# EAGLE design model140 (EAGLE 7.7.0)
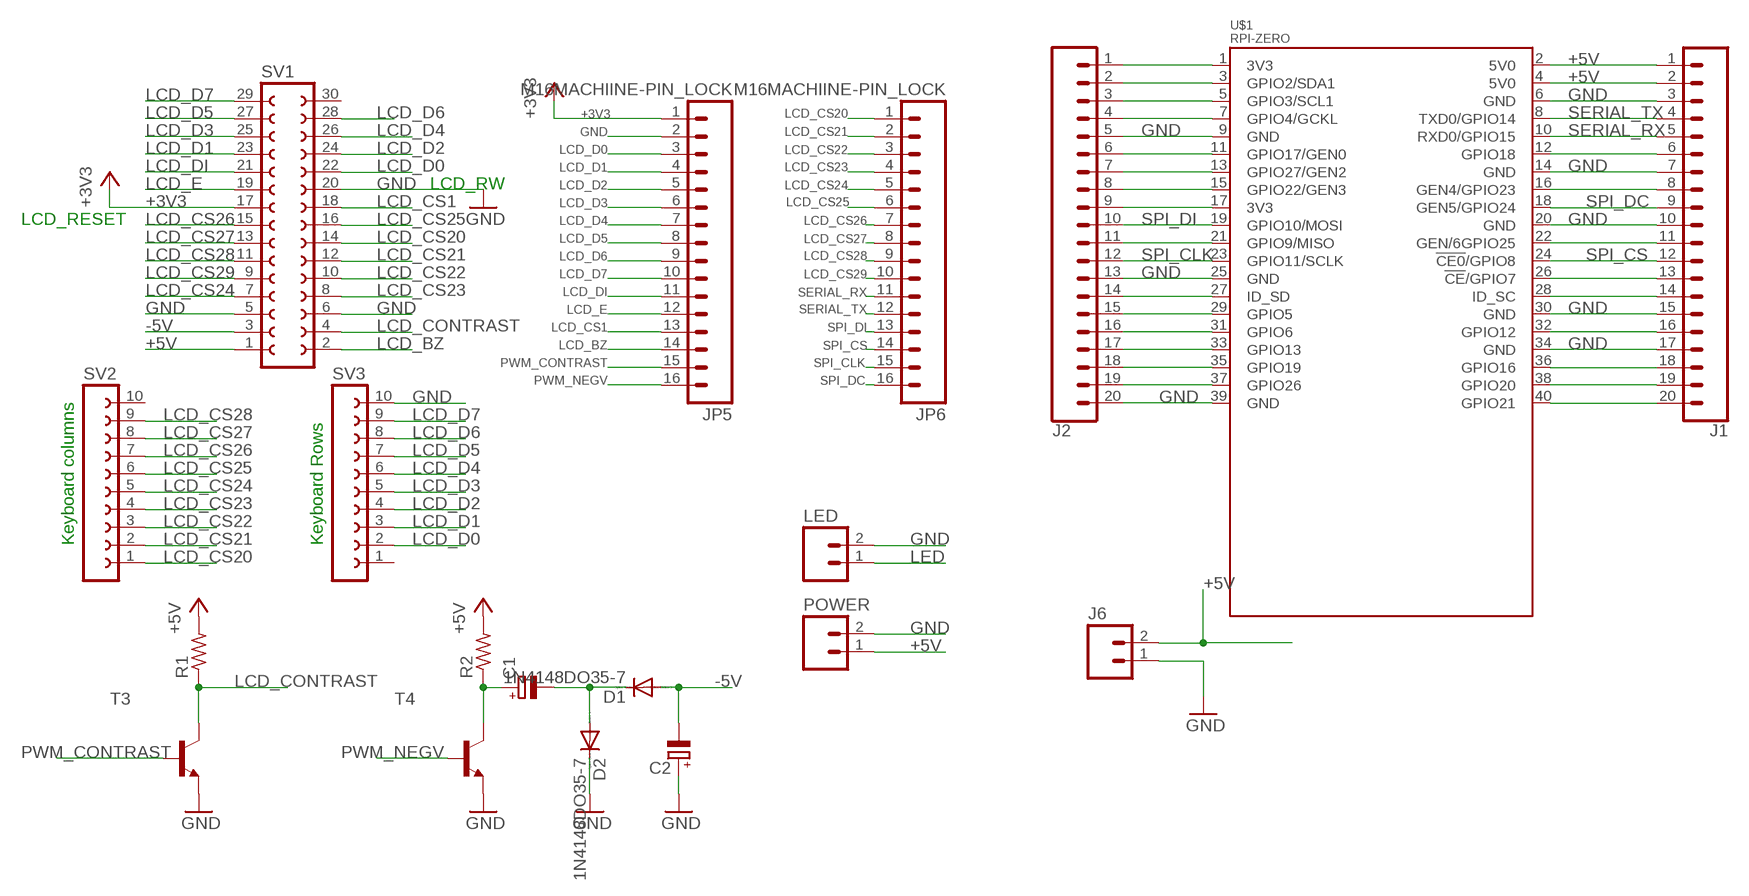
[diagram p0: schematic, sheet 1]

## Parts
C1  CPOL-EUE2.5-7  [E2,5-7]
C2  CPOL-EUE2.5-7  [E2,5-7]
D1  1N4148DO35-7  [DO35-7]
D2  1N4148DO35-7  [DO35-7]
J1  CONN_20  [1X20]
J2  CONN_20  [1X20]
J6  M02PTH  [1X02]
JP5  M16MACHIINE-PIN_LOCK  [1X16_MACHINE-PIN-HEADER_LOCK.004@1]
JP6  M16MACHIINE-PIN_LOCK  [1X16_MACHINE-PIN-HEADER_LOCK.004@1]
LED  M02PTH  [1X02]
POWER  M02PTH  [1X02]
R1  R-US_0204/5  [0204/5]
R2  R-US_0204/5  [0204/5]
SV1  FE15-2  [FE15-2]
SV2  FE10W  [FE10W]
SV3  FE10W  [FE10W]
T3  MPS2222A-NPN-TO92-CBE  [TO92-CBE]
T4  MPS2222A-NPN-TO92-CBE  [TO92-CBE]
U$1  RPI-ZERO  [RASP_PI_ZERO_BOARD_FULL]

## Nets
3V3@1: J2.1 U$1.1(3V3)
3V3@2: J2.9 U$1.17(3V3)
+3V3: JP5.1 SV1.17
+5V: J1.1 J1.2 J6.2 POWER.1 R1.2 R2.2 SV1.1 U$1.2(5V0) U$1.4(5V0)
-5V: C2.- D1.A SV1.3
GND: C2.+ D2.C J1.3 J1.7 J1.10 J1.15 J1.17 J2.5 J2.13 J2.20 J6.1 JP5.2 LED.2 POWER.2 SV1.5 SV1.6 SV1.20 SV3.10 T3.E T4.E U$1.6(GND) U$1.9(GND) U$1.14(GND) U$1.20(GND) U$1.25(GND) U$1.30(GND) U$1.34(GND) U$1.39(GND)
LCD_BZ: JP5.14 SV1.2
LCD_CONTRAST: R1.1 SV1.4 T3.C
LCD_CS1: JP5.13 SV1.18
LCD_CS20: JP6.1 SV1.14 SV2.1
LCD_CS21: JP6.2 SV1.12 SV2.2
LCD_CS22: JP6.3 SV1.10 SV2.3
LCD_CS23: JP6.4 SV1.8 SV2.4
LCD_CS24: JP6.5 SV1.7 SV2.5
LCD_CS25: JP6.6 SV1.16 SV2.6
LCD_CS26: JP6.7 SV1.15 SV2.7
LCD_CS27: JP6.8 SV1.13 SV2.8
LCD_CS28: JP6.9 SV1.11 SV2.9
LCD_CS29: JP6.10 SV1.9
LCD_D0: JP5.3 SV1.22 SV3.2
LCD_D1: JP5.4 SV1.23 SV3.3
LCD_D2: JP5.5 SV1.24 SV3.4
LCD_D3: JP5.6 SV1.25 SV3.5
LCD_D4: JP5.7 SV1.26 SV3.6
LCD_D5: JP5.8 SV1.27 SV3.7
LCD_D6: JP5.9 SV1.28 SV3.8
LCD_D7: JP5.10 SV1.29 SV3.9
LCD_DI: JP5.11 SV1.21
LCD_E: JP5.12 SV1.19
LED: LED.1
N$1: J2.2 U$1.3(GPIO2/SDA1)
N$2: J2.3 U$1.5(GPIO3/SCL1)
N$3: J2.4 U$1.7(GPIO4/GCKL)
N$4: J2.6 U$1.11(GPIO17/GEN0)
N$5: J2.7 U$1.13(GPIO27/GEN2)
N$6: J2.8 U$1.15(GPIO22/GEN3)
N$7: J2.11 U$1.21(GPIO9/MISO)
N$8: J2.14 U$1.27(ID_SD)
N$9: J2.15 U$1.29(GPIO5)
N$10: J2.16 U$1.31(GPIO6)
N$11: J2.17 U$1.33(GPIO13)
N$12: J2.18 U$1.35(GPIO19)
N$13: J2.19 U$1.37(GPIO26)
N$14: J1.20 U$1.40(GPIO21)
N$15: J1.19 U$1.38(GPIO20)
N$16: J1.18 U$1.36(GPIO16)
N$17: J1.16 U$1.32(GPIO12)
N$18: J1.14 U$1.28(ID_SC)
N$19: J1.13 U$1.26(!CE!/GPIO7)
N$20: J1.11 U$1.22(GEN/6GPIO25)
N$21: J1.8 U$1.16(GEN4/GPIO23)
N$22: J1.6 U$1.12(GPIO18)
N$27: C1.+ R2.1 T4.C
N$28: C1.- D1.C D2.A
PWM_CONTRAST: JP5.15 T3.B
PWM_NEGV: JP5.16 T4.B
SERIAL_RX: J1.5 JP6.11 U$1.10(RXD0/GPIO15)
SERIAL_TX: J1.4 JP6.12 U$1.8(TXD0/GPIO14)
SPI_CLK: J2.12 JP6.15 U$1.23(GPIO11/SCLK)
SPI_CS: J1.12 JP6.14 U$1.24(!CE0!/GPIO8)
SPI_DC: J1.9 JP6.16 U$1.18(GEN5/GPIO24)
SPI_DI: J2.10 JP6.13 U$1.19(GPIO10/MOSI)
Unconnected: SV1.30 SV2.10 SV3.1

## Notes on the sheet
- LCD_RW
- LCD_RESET
- Keyboard columns | Keyboard Rows

## Library data of the parts
C1 C2 = rcl:CPOL-EU: POLARIZED CAPACITOR, European symbol
D1 D2 = diode:1N4148: DIODE high speed (Philips)
J1 J2 = SparkFun-Connectors:CONN_20: Multi connection point. Often used as Generic Header-pin footprint for 0.1 inch spaced/style header connections On any of the 0.1 inch spaced packages, you can populate with these: Break Away Headers - Straight <https://www.sparkfun.com/products/116> (PRT-00116) Break Away Male Headers - Right Angle <https://www.sparkfun.com/products/553> (PRT-00553) Female Headers <https://www.sparkfun.com/products/115> (PRT-00115) Break Away Headers - Machine Pin <https://www.sparkfun.com/products/117> (PRT-00117) Break Away Female Headers - Swiss Machine Pin <https://www.sparkfun.com/products/743> (PRT-00743) For SCREWTERMINALS and SPRING TERMINALS visit here: Screw Terimnals on SparkFun.com <https://www.sparkfun.com/search/results?term=Screw+Terminals> (5mm/3.5mm/2.54mm spacing) This device is also useful as a general connection point to wire up your design to another part of your project. Our various solder wires solder well into these plated through hole pads. Hook-Up Wire - Assortment (Stranded, 22 AWG) <https://www.sparkfun.com/products/11375> (PRT-11375) Hook-Up Wire - Assortment (Solid Core, 22 AWG) <https://www.sparkfun.com/products/11367> (PRT-11367) View the entire wire category on our website here <https://www.sparkfun.com/categories/141> Special notes: Molex polarized connector foot print use with SKU : PRT-08231 with associated crimp pins and housings. 1MM SMD Version SKU: PRT-10208 NOTES ON THE VARIANTS LOCK and LOCK_LONGPADS... This footprint was designed to help hold the alignment of a through-hole component (i.e. 6-pin header) while soldering it into place. You may notice that each hole has been shifted either up or down by 0.005 of an inch from it's more standard position (which is a perfectly straight line). This slight alteration caused the pins (the squares in the middle) to touch the edges of the holes. Because they are alternating, it causes a "brace" to hold the component in place. 0.005 has proven to be the perfect amount of "off-center" position when using our standard breakaway headers. Although looks a little odd when you look at the bare footprint, once you have a header in there, the alteration is very hard to notice. Also,if you push a header all the way into place, it is covered up entirely on the bottom side. Note about LOCK SPECIAL package: This is just like the LOCK variant in that the holes are staggared by 5 mil, but except for the last two holes. They are not altered from the "standard" footprint layout. This is used for a special purpose on the layout of our Graphic LCD Backpack. Make sure you want to use this device before selecting it for you project!
J6 LED POWER = SparkFun-Connectors:M02: Standard 2-pin 0.1" header. Use with - straight break away headers ( PRT-00116) - right angle break away headers (PRT-00553) - swiss pins (PRT-00743) - machine pins (PRT-00117) - female headers (PRT-00115) Molex polarized connector foot print use with: PRT-08233 with associated crimp pins and housings. 2.54_SCREWTERM for use with PRT-10571. 3.5mm Screw Terminal footprints for PRT-08084 5mm Screw Terminal footprints for use with PRT-08432
JP5 JP6 = SparkFun-Connectors:M16: 1x16 .1" header
R1 R2 = rcl:R-US_: RESISTOR, American symbol
SV1 = con-lsta:FE15-2: FEMALE HEADER; OC_FARNELL: unknown; OC_NEWARK: unknown
SV2 SV3 = con-lsta:FE10W: FEMALE HEADER; OC_FARNELL: unknown; OC_NEWARK: unknown
T3 T4 = transistor:*-NPN-: NPN Transistror BF959 corrected 2008.03.06
U$1 = rpi-zero:RPI-ZERO

## Board
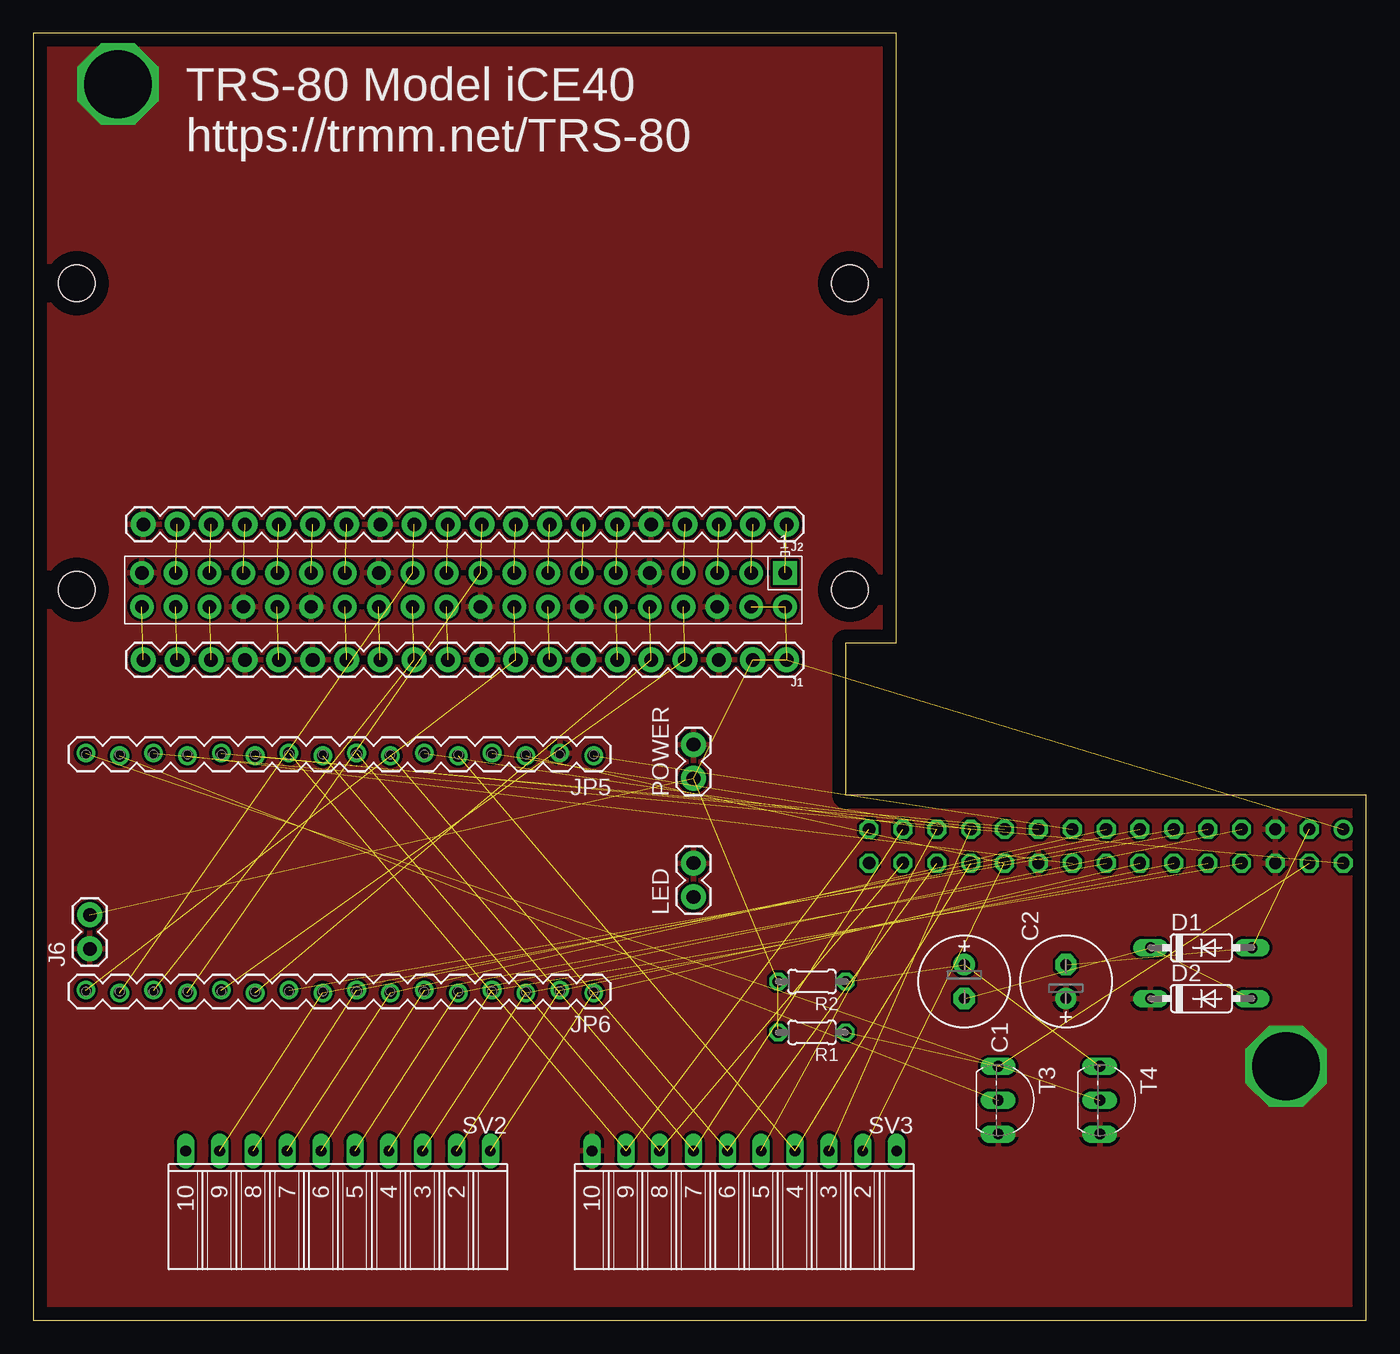
[diagram p1: board, top side]
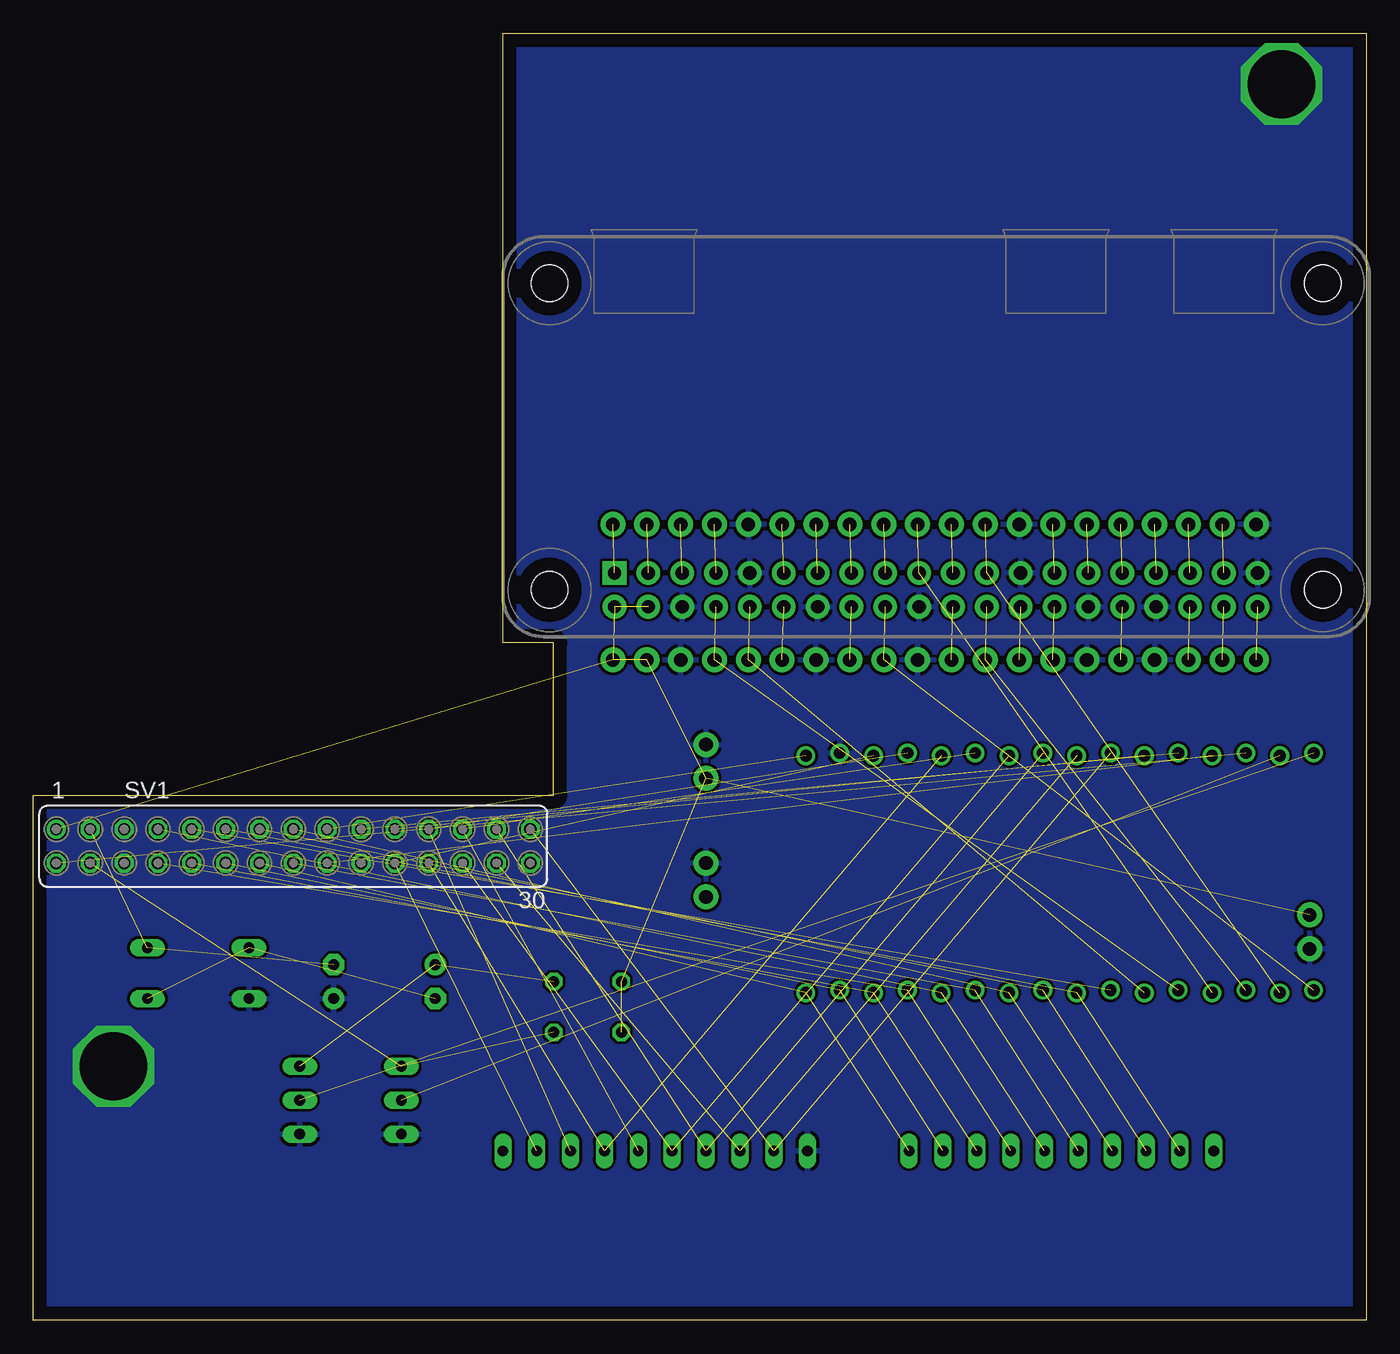
[diagram p2: board, bottom side, seen from below]

Size 100 x 96.52 mm. Coordinates in mm from the lower left corner, seen from the top.
Outline: 0,0 100,0 100,39.36 60.96,39.36 60.96,50.8 64.77,50.8 64.77,96.52 0,96.51 0,0
Copper layers (1*16): Top 0.035mm / dielectric 1.5mm / Bottom 0.035mm
Design rules "default": minimum track width 10mil, minimum drill 24mil, track to track 8mil, track to pad 8mil, pad to pad 8mil, via to via 8mil, smd to smd 8mil, copper to edge 40mil, drill to drill 8mil, minimum pad ring 10mil, minimum via ring 8mil, stop-mask expansion 4mil, vias tented up to drill 0mil, thermal gap 10mil

### Footprints (pad centres in the part's own frame; a part is rotated, then mirrored left to right if it is on the bottom)
E2,5-7 = drill 0.813 pad 1.6: + -1.27,0 | drill 0.813 pad 1.6 octagon: - 1.27,0
DO35-7 = drill 0.813 long: A 3.81,0; C -3.81,0
1X20 = drill 1.016 pad 1.88: 1 0,0; 2 2.54,0; 3 5.08,0; 4 7.62,0; 5 10.16,0; 6 12.7,0; 7 15.24,0; 8 17.78,0; 9 20.32,0; 10 22.86,0; 11 25.4,0; 12 27.94,0; 13 30.48,0; 14 33.02,0; 15 35.56,0; 16 38.1,0; 17 40.64,0; 18 43.18,0; 19 45.72,0; 20 48.26,0
1X02 = drill 1.016 pad 1.88: 1 0,0; 2 2.54,0
1X16_MACHINE-PIN-HEADER_LOCK.004@1 = drill 0.889: 1 0,0.102; 2 2.54,-0.102; 3 5.08,0.102; 4 7.62,-0.102; 5 10.16,0.102; 6 12.7,-0.102; 7 15.24,0.102; 8 17.78,-0.102; 9 20.32,0.102; 10 22.86,-0.102; 11 25.4,0.102; 12 27.94,-0.102; 13 30.48,0.102; 14 33.02,-0.102; 15 35.56,0.102; 16 38.1,-0.102
0204/5 = drill 0.813 octagon: 1 -2.54,0; 2 2.54,0
FE15-2 = drill 0.914: 1 -17.78,1.27 | drill 0.914 octagon: 2 -17.78,-1.27; 3 -15.24,1.27; 4 -15.24,-1.27; 5 -12.7,1.27; 6 -12.7,-1.27; 7 -10.16,1.27; 8 -10.16,-1.27; 9 -7.62,1.27; 10 -7.62,-1.27; 11 -5.08,1.27; 12 -5.08,-1.27; 13 -2.54,1.27; 14 -2.54,-1.27; 15 0,1.27; 16 0,-1.27; 17 2.54,1.27; 18 2.54,-1.27; 19 5.08,1.27; 20 5.08,-1.27; 21 7.62,1.27; 22 7.62,-1.27; 23 10.16,1.27; 24 10.16,-1.27; 25 12.7,1.27; 26 12.7,-1.27; 27 15.24,1.27; 28 15.24,-1.27; 29 17.78,1.27; 30 17.78,-1.27
FE10W = drill 0.813 long: 1 -11.43,0; 2 -8.89,0; 3 -6.35,0; 4 -3.81,0; 5 -1.27,0; 6 1.27,0; 7 3.81,0; 8 6.35,0; 9 8.89,0; 10 11.43,0
TO92-CBE = drill 0.813 long: B 0,0; C -2.54,0; E 2.54,0
RASP_PI_ZERO_BOARD_FULL = drill 1 pad 1.778 square: 1 8.37,25.23 | drill 1 pad 1.778: 2 8.37,27.77; 3 10.91,25.23; 4 10.91,27.77; 5 13.45,25.23; 6 13.45,27.77; 7 15.99,25.23; 8 15.99,27.77; 9 18.53,25.23; 10 18.53,27.77; 11 21.07,25.23; 12 21.07,27.77; 13 23.61,25.23; 14 23.61,27.77; 15 26.15,25.23; 16 26.15,27.77; 17 28.69,25.23; 18 28.69,27.77; 19 31.23,25.23; 20 31.23,27.77; 21 33.77,25.23; 22 33.77,27.77; 23 36.31,25.23; 24 36.31,27.77; 25 38.85,25.23; 26 38.85,27.77; 27 41.39,25.23; 28 41.39,27.77; 29 43.93,25.23; 30 43.93,27.77; 31 46.47,25.23; 32 46.47,27.77; 33 49.01,25.23; 34 49.01,27.77; 35 51.55,25.23; 36 51.55,27.77; 37 54.09,25.23; 38 54.09,27.77; 39 56.63,25.23; 40 56.63,27.77 | hole 2.75: 3.5,3.5; 3.5,26.5; 61.5,3.5; 61.5,26.5

### Placement (x,y rotation side)
C1  69.85,25.4 270 top
C2  77.47,25.4 90 top
D1  87.63,27.94 0 top
D2  87.63,24.13 0 top
J1  56.52,49.53 180 top
J2  56.52,59.69 180 top
J6  4.24,27.86 90 top
JP5  42.04,42.44 180 top
JP6  42.04,24.66 180 top
LED  49.53,31.75 90 top
POWER  49.53,40.64 90 top
R1  58.42,21.59 180 top
R2  58.42,25.4 180 top
SV1  80.49,35.56 0 bottom
SV2  22.86,12.7 180 top
SV3  53.34,12.7 180 top
T3  72.39,16.51 270 top
T4  80.01,16.51 270 top
U$1  64.77,81.28 180 top

### Tracks (layer width: path | path; a pad name or v marks a point on that pad's centre or on a via)
3V3@1  (1 unrouted)
3V3@2  (1 unrouted)
+3V3  (1 unrouted)
+5V  (8 unrouted)
-5V  (2 unrouted)
GND  (via drill 5.08 pad 2.54)
  other vias: 6.35,92.71 93.98,19.05
  pour Bottom: 0,96.52 105.41,96.52 105.41,-1.27 0,-1.27
  pour Top: 0,96.52 104.14,96.52 104.14,0 0,0
LCD_BZ  (1 unrouted)
LCD_CONTRAST  (2 unrouted)
LCD_CS1  (1 unrouted)
LCD_CS20  (2 unrouted)
LCD_CS21  (2 unrouted)
LCD_CS22  (2 unrouted)
LCD_CS23  (2 unrouted)
LCD_CS24  (2 unrouted)
LCD_CS25  (2 unrouted)
LCD_CS26  (2 unrouted)
LCD_CS27  (2 unrouted)
LCD_CS28  (2 unrouted)
LCD_CS29  (1 unrouted)
LCD_D0  (2 unrouted)
LCD_D1  (2 unrouted)
LCD_D2  (2 unrouted)
LCD_D3  (2 unrouted)
LCD_D4  (2 unrouted)
LCD_D5  (2 unrouted)
LCD_D6  (2 unrouted)
LCD_D7  (2 unrouted)
LCD_DI  (1 unrouted)
LCD_E  (1 unrouted)
N$1  (1 unrouted)
N$2  (1 unrouted)
N$3  (1 unrouted)
N$4  (1 unrouted)
N$5  (1 unrouted)
N$6  (1 unrouted)
N$7  (1 unrouted)
N$8  (1 unrouted)
N$9  (1 unrouted)
N$10  (1 unrouted)
N$11  (1 unrouted)
N$12  (1 unrouted)
N$13  (1 unrouted)
N$14  (1 unrouted)
N$15  (1 unrouted)
N$16  (1 unrouted)
N$17  (1 unrouted)
N$18  (1 unrouted)
N$19  (1 unrouted)
N$20  (1 unrouted)
N$21  (1 unrouted)
N$22  (1 unrouted)
N$27  (2 unrouted)
N$28  (2 unrouted)
PWM_CONTRAST  (1 unrouted)
PWM_NEGV  (1 unrouted)
SERIAL_RX  (2 unrouted)
SERIAL_TX  (2 unrouted)
SPI_CLK  (2 unrouted)
SPI_CS  (2 unrouted)
SPI_DC  (2 unrouted)
SPI_DI  (2 unrouted)

### Text on the board
tNames: TRS-80 Model iCE40 | https://trmm.net/TRS-80